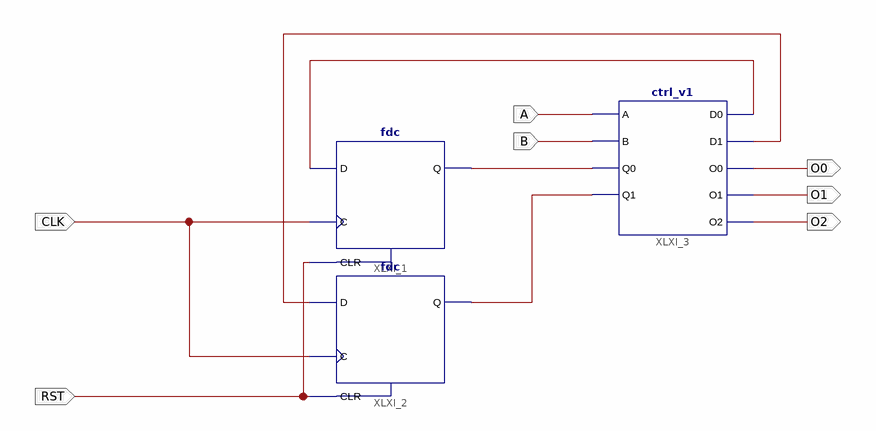
[diagram p0: schematic sheet 1]
// Xilinx ISE schematic Examen4.sch (spartan3) as structural Verilog: 3 symbols, 7 ports
module Examen4 (
  input  CLK,
  input  RST,
  input  A,
  input  B,
  output O0,
  output O1,
  output O2
);

  wire XLXN_1, XLXN_2, XLXN_3, XLXN_4;

  fdc XLXI_1 (.C(CLK), .CLR(RST), .D(XLXN_3), .Q(XLXN_1));
  fdc XLXI_2 (.C(CLK), .CLR(RST), .D(XLXN_4), .Q(XLXN_2));
  ctrl_v1 XLXI_3 (.A(A), .B(B), .D0(XLXN_3), .D1(XLXN_4), .O0(O0), .O1(O1), .O2(O2), .Q0(XLXN_1), .Q1(XLXN_2));
endmodule
